# Altium schematic sheet controller.schdoc: RaToPUS DC/DC: Controller
size A4; Author: Lalit Patnaik; Organization: BE-CO-HT, CERN; Address1: Esplanade des Particules 1; Address2: 1217 Meyrin, Switzerland; Revision: 0.3; SheetNumber: 3; SheetTotal: 3
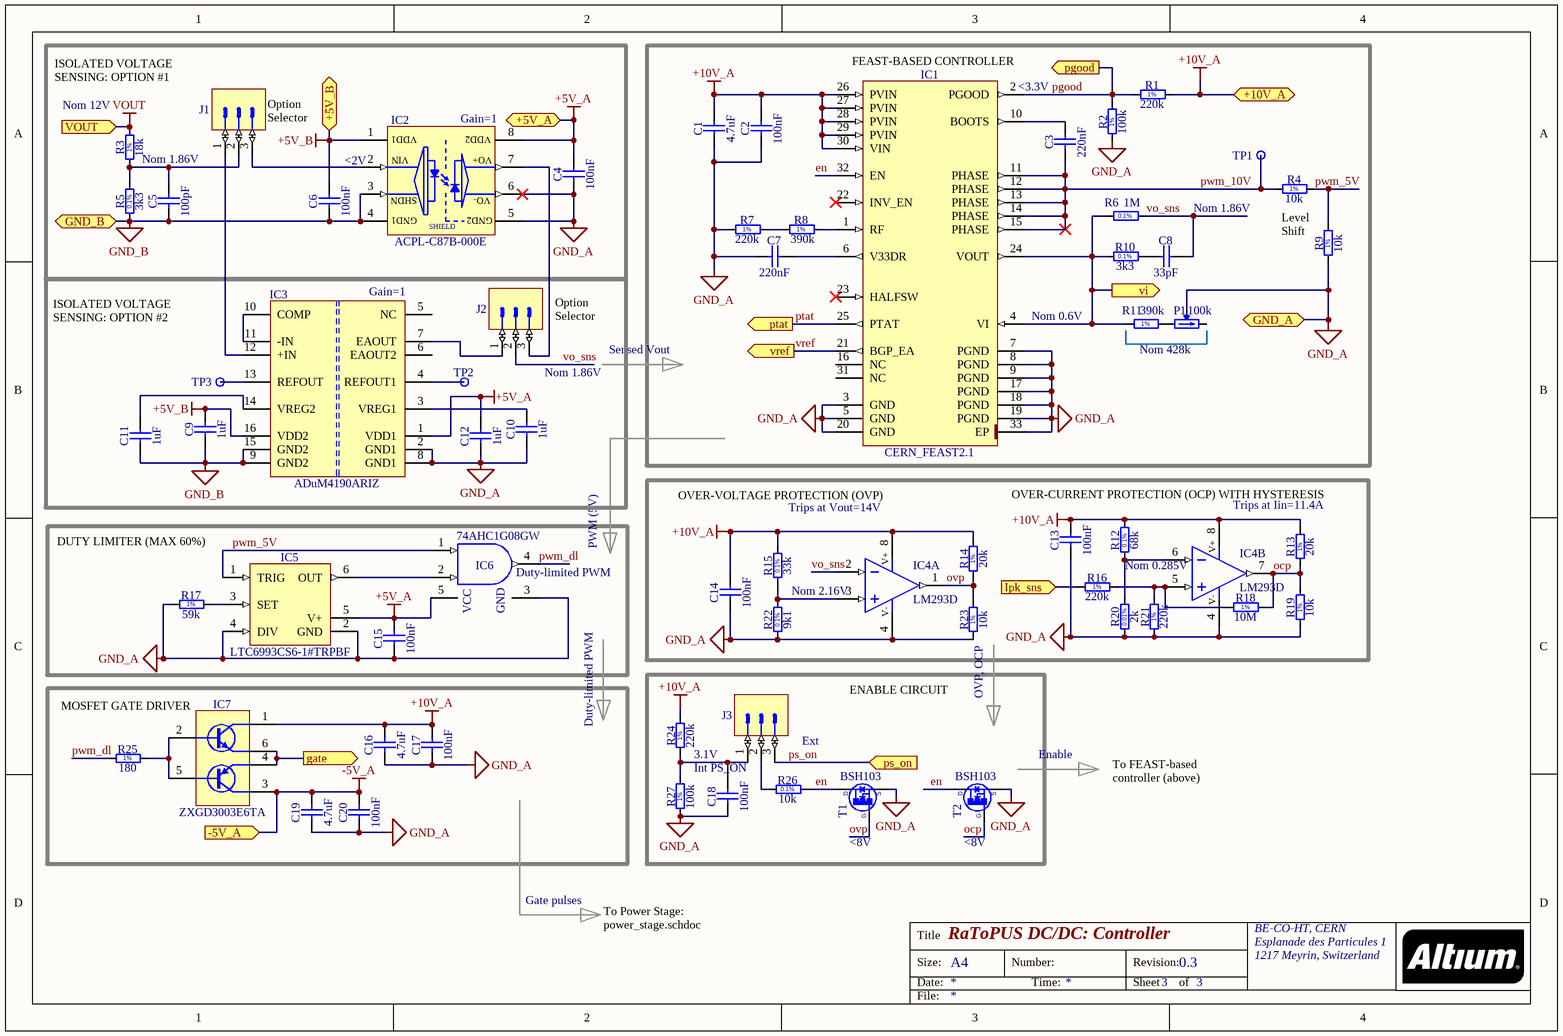
[diagram p0: controller.schdoc]

## Parts
C1  4.7uF  [CAPC2012X135N]
C2  100nF  [CAPC2012X135N]
C3  220nF  [CAPC2012X135N]
C4  100nF  [CAPC2012X135N]
C5  100pF  [CAPC2012X88N]
C6  100nF  [CAPC2012X135N]
C7  220nF  [CAPC2012X135N]
C8  33pF  [CAPC2012X88N]
C9  1uF  [CAPC3216X140N]
C10  1uF  [CAPC3216X140N]
C11  1uF  [CAPC3216X140N]
C12  1uF  [CAPC3216X140N]
C13  100nF  [CAPC2012X135N]
C14  100nF  [CAPC2012X135N]
C15  100nF  [CAPC2012X135N]
C16  4.7uF  [CAPC2012X135N]
C17  100nF  [CAPC2012X135N]
C18  100nF  [CAPC2012X135N]
C19  4.7uF  [CAPC2012X135N]
C20  100nF  [CAPC2012X135N]
IC1  CERN_FEAST2.1  [CERN_FEAST2.1]
IC2  ACPL-C87B-000E  [AVAGO_ACPL-C87B]
IC3  ADuM4190ARIZ  [SOIC127P1031X264-16N]
IC4  LM293D  [SOIC127P600X175-8N]  (parts A,B of 2)
IC5  LTC6993CS6-1#TRPBF  [SOT95P280X100-6N]
IC6  74AHC1G08GW  [SOT65P212X110-5N]
IC7  ZXGD3003E6TA  [SOT95P285X140-6N]
J1  Header 3  [JST_B3B-XH-A(LF)(SN)]  (value not drawn)
J2  Header 3  [JST_B3B-XH-A(LF)(SN)]  (value not drawn)
J3  Header 3  [JST_B3B-XH-A(LF)(SN)]  (value not drawn)
P1  100k  [TRIM_VISHAY_TSM4YL]
R1  220k  [RESC2012X60N]
R2  100k  [RESC2012X60N]
R3  18k  [RESC2012X60N]
R4  10k  [RESC2012X60N]
R5  3k3  [RESC2012X60N]
R6  1M  [RESC2012X60N]
R7  220k  [RESC2012X60N]
R8  390k  [RESC2012X60N]
R9  10k  [RESC2012X60N]
R10  3k3  [RESC2012X60N]
R11  390k  [RESC2012X60N]
R12  68k  [RESC2012X60N]
R13  20k  [RESC2012X60N]
R14  20k  [RESC2012X60N]
R15  33k  [RESC2012X60N]
R16  220k  [RESC2012X60N]
R17  59k  [RESC2012X60N]
R18  10M  [RESC2012X60N]
R19  10k  [RESC2012X60N]
R20  2k  [RESC2013X64N]
R21  220k  [RESC2012X60N]
R22  9k1  [RESC2012X60N]
R23  10k  [RESC2012X60N]
R24  220k  [RESC2012X60N]
R25  180  [RESC2012X60N]
R26  10k  [RESC2012X60N]
R27  100k  [RESC2012X60N]
T1  BSH103  [SOT95P230X110-3N]
T2  BSH103  [SOT95P230X110-3N]
TP1  Test Point  [VERO_20-2136]  (value not drawn)
TP2  Test Point  [VERO_20-2136]  (value not drawn)
TP3  Test Point  [VERO_20-2136]  (value not drawn)

## Blocks framed on the sheet
Duty-limited PWM: C16 C17 C19 C20 IC7 R25

## Ports
+5V_A, +5V_B, +10V_A, -5V_A (in), gate (out), GND_A, GND_B, Ipk_sns (in), pgood (out), ps_on (in), ptat (out), vi (out), VOUT (in), vref (out)

## Nets
+5V_A: C4.2 C12.2 C15.2 IC2.8(VDD2) IC3.1(VDD1) IC5.5(V+) IC6.5(VCC) ; port +5V_A
+5V_B: C6.2 C9.2 IC2.1(VDD1) IC3.16(VDD2) ; port +5V_B
+10V_A: C1.2 C2.2 C13.2 C14.2 C16.2 C17.2 IC1.26(PVIN) IC1.27(PVIN) IC1.28(PVIN) IC1.29(PVIN) IC1.30(VIN) IC4.8(V+) IC7.1(VCC) R1.2 R12.2 R13.2 R14.2 R15.2 R24.2 ; port +10V_A
-5V_A: C19.2 C20.2 IC7.3(VEE) ; port -5V_A
GND_A: C1.1 C2.1 C4.1 C7.1 C10.1 C12.1 C13.1 C14.1 C15.1 C16.1 C17.1 C18.1 C19.1 C20.1 IC1.3(GND) IC1.5(GND) IC1.7(PGND) IC1.8(PGND) IC1.9(PGND) IC1.17(PGND) IC1.18(PGND) IC1.19(PGND) IC1.20(GND) IC1.33(EP) IC2.5(GND2) IC2.6(VOUT-) IC3.2(GND1) IC3.8(GND1) IC4.4(V-) IC5.2(GND) IC5.4(DIV) IC6.3(GND) P1.2(W) R2.1 R7.1 R9.1 R17.1 R19.1 R20.1 R21.1 R22.1 R23.1 R27.1 T1.2(S) T2.2(S) ; port GND_A
GND_B: C5.1 C6.1 C9.1 C11.1 IC2.3(SHDN) IC2.4(GND1) IC3.9(GND2) IC3.15(GND2) R5.1 ; port GND_B
VOUT: R3.2 ; port VOUT
en: IC1.32(EN) R26.2 T1.3(D) T2.3(D)
gate: IC7.4(SINK) IC7.6(S) ; port gate
Ipk_sns: R16.1 ; port Ipk_sns
ocp: IC4.7(OUT) R13.1 R18.2 R19.2 T2.1(G)
ovp: IC4.1(OUT) R14.1 R23.2 T1.1(G)
pgood: IC1.2(PGOOD) R1.1 R2.2 ; port pgood
ps_on: J3.3 ; port ps_on
ptat: IC1.25(PTAT) ; port ptat
pwm_5V: IC5.1(TRIG) IC6.1(B) R4.2 R9.2
pwm_10V: C3.1 IC1.11(PHASE) IC1.12(PHASE) IC1.13(PHASE) IC1.14(PHASE) IC1.15(PHASE) R4.1 TP1.1
pwm_dl: IC6.4(Y) R25.1
vi: IC1.4(VI) IC1.24(VOUT) R6.1 R10.1 R11.1 ; port vi
vo_sns: C8.2 IC4.2(IN-) J2.2 R6.2
vref: IC1.21(BGP_EA) ; port vref
NetC3_2: C3.2 IC1.10(BOOTS)
NetC5_2: C5.2 J1.2 R3.1 R5.2
NetC7_2: C7.2 IC1.6(V33DR)
NetC8_1: C8.1 R10.2
NetC10_2: C10.2 IC3.3(VREG1)
NetC11_2: C11.2 IC3.14(VREG2)
NetC18_2: C18.2 J3.1 R24.1 R27.2
NetIC1_1: IC1.1(RF) R8.2
NetIC2_2: IC2.2(VIN) J1.3
NetIC2_7: IC2.7(VOUT+) J2.3
NetIC3_4: IC3.4(REFOUT1) TP2.1
NetIC3_7: IC3.7(EAOUT) J2.1
NetIC3_10: IC3.10(COMP) IC3.11(-IN)
NetIC3_12: IC3.12(+IN) J1.1
NetIC3_13: IC3.13(REFOUT) TP3.1
NetIC4_3: IC4.3(IN+) R15.1 R22.2
NetIC4_5: IC4.5(IN+) R16.2 R18.1 R21.2
NetIC4_6: IC4.6(IN-) R12.1 R20.2
NetIC5_3: IC5.3(SET) R17.2
NetIC5_6: IC5.6(OUT) IC6.2(A)
NetIC7_2: IC7.2(IN1) IC7.5(IN2) R25.2
NetJ3_2: J3.2 R26.1
NetP1_1: P1.1(CCW) R11.2
NetR7_2: R7.2 R8.1

Not connected (* = marked no-connect by the designer): IC1 16(NC) 22(INV_EN)* 23(HALFSW)* 31(NC); IC3 5(NC) 6(EAOUT2); P1 3(CW)

## Notes on the sheet
- ISOLATED VOLTAGE SENSING: OPTION #1
- (near R3) Nom 12V
- (near IC1) FEAST-BASED CONTROLLER
- (near IC1) <3.3V
- (near R3) Nom 1.86V
- (near J1) Option Selector
- <2V
- (near IC2) Gain=1
- Nom 1.86V
- Level Shift
- (near IC3) Gain=1
- ISOLATED VOLTAGE SENSING: OPTION #2
- (near J2) Option Selector
- Sensed Vout
- Nom 0.6V
- Nom 428k
- OVER-VOLTAGE PROTECTION (OVP)
- Trips at Vout=14V
- OVER-CURRENT PROTECTION (OCP) WITH HYSTERESIS
- Trips at Iin=11.4A
- DUTY LIMITER (MAX 60%)
- (near IC6) Duty-limited PWM
- PWM (5V)
- Nom 0.285V
- (near IC6) VCC
- (near IC6) GND
- Nom 2.16V
- (near IC7) MOSFET GATE DRIVER
- ENABLE CIRCUIT
- (near R23) OVP, OCP
- (near R24) 3.1V
- Int PS_ON
- Ext
- Enable
- To FEAST-based controller (above)
- (near T1) <8V
- (near T2) <8V
- Gate pulses
- To Power Stage:
  power_stage.schdoc
- Title
- Size:
- Date:
- A4
- Number:
- Time:
- Revision:
- Sheet
- of
- File:
- (in symbol ACPL-C87B-000E) VO+; VO-; SHIELD
- (in symbol R0805_1M_0.1%_0.1W_25PPM) 0.1%
- (in symbol R0805_2K_0.01%_0.2W_0.2PPM_VISHAY_VSMP) 0.01%
- (in symbol R0805_3K3_0.1%_0.125W_25PPM) 0.1%
- (in symbol R0805_9K1_0.1%_0.1W_10PPM) 0.1%
- (in symbol R0805_10K_0.1%_0.1W_10PPM) 0.1%
- (in symbol R0805_10K_1%_0.125W_100PPM) 1%
- (in symbol R0805_10M_1%_0.125W_100PPM) 1%
- (in symbol R0805_18K_1%_0.125W_100PPM) 1%
- (in symbol R0805_20K_1%_0.125W_100PPM) 1%
- (in symbol R0805_33K_0.1%_0.125W_25PPM) 0.1%
- (in symbol R0805_59K_1%_0.125W_100PPM) 1%
- (in symbol R0805_68K_0.1%_0.125W_25PPM) 0.1%
- (in symbol R0805_100K_1%_0.125W_100PPM) 1%
- (in symbol R0805_180R_1%_0.125W_100PPM) 1%
- (in symbol R0805_220K_1%_0.125W_100PPM) 1%
- (in symbol R0805_390K_1%_0.125W_100PPM) 1%

## Library data of the parts
C1 C16 C19 = CC0805_4.7UF_16V_10%_X7R: Non-polarised capacitor; Part Description: SMD Multilayer Chip Ceramic Capacitor; Manufacturer: GENERIC; Manufacturer1 Part Number: EMK212B7475KG-T; Voltage: 16V; TC: X7R; Tolerance: ±10%; Part Number: CC0805_4.7UF_16V_10%_X7R; Component Kind: Standard; Component Type: Standard; Pin Count: 2; Value: 4.7uF; Status: Preferred; Manufacturer Part Number: CC0805_4.7UF_16V_10%_X7R; Case: 0805; Mounted: Yes; Socket: No; SMD: Yes; Sense: No; Manufacturer1 Example: TAIYO YUDEN; Manufacturer1 ComponentHeight: 1.35mm; HelpURL: \\cern.ch\dfs\Applications\Altium\Datasheets\CC0805_X7R_TAIYO-YUDEN_HIGH-VALUE.pdf; Author: CERN DEM JLC; CreateDate: 16/09/2014; LatestRevisionDate: 16/09/2014
C2 C4 C6 C13-C15 C17 C18 C20 = CC0805_100NF_50V_10%_X7R: Non-polarised capacitor; Part Description: SMD Multilayer Chip Ceramic Capacitor; Manufacturer: GENERIC; Manufacturer1 Part Number: C2012X7R1H104K085AA; Voltage: 50V; TC: X7R; Tolerance: ±10%; Part Number: CC0805_100NF_50V_10%_X7R; Component Kind: Standard; Component Type: Standard; Pin Count: 2; Value: 100nF; Status: Preferred; Manufacturer Part Number: CC0805_100NF_50V_10%_X7R; Case: 0805; Mounted: Yes; Socket: No; SMD: Yes; Sense: No; Manufacturer1 Example: TDK; Manufacturer1 ComponentHeight: 1mm; HelpURL: \\cern.ch\dfs\Applications\Altium\Datasheets\CC0805_X7R_TDK_C.pdf; Author: CERN DEM JLC; CreateDate: 03/12/2007; LatestRevisionDate: 22/04/2015
C3 C7 = CC0805_220NF_50V_10%_X7R: Non-polarised capacitor; Part Description: SMD Multilayer Chip Ceramic Capacitor; Manufacturer: GENERIC; Manufacturer1 Part Number: GRM21BR71H224KA01L; Voltage: 50V; TC: X7R; Tolerance: ±10%; Part Number: CC0805_220NF_50V_10%_X7R; Component Kind: Standard; Component Type: Standard; Pin Count: 2; Value: 220nF; Status: Preferred; Manufacturer Part Number: CC0805_220NF_50V_10%_X7R; Case: 0805; Mounted: Yes; Socket: No; SMD: Yes; Sense: No; Manufacturer1 Example: MURATA; Manufacturer1 ComponentHeight: 1.35mm; HelpURL: \\cern.ch\dfs\Applications\Altium\Datasheets\CC0805_X7R_MURATA.pdf; Author: CERN DEM JLC; CreateDate: 03/12/2007; LatestRevisionDate: 03/12/2007
C5 = CC0805_100PF_50V_5%_C0G_KEMET_C0805C101J5GACAUTO: Non-polarised capacitor; Part Description: SMD Multilayer Chip Ceramic Capacitor (Automotive Grade); Manufacturer: KEMET; Voltage: 50V; TC: C0G/NP0; Tolerance: ±5%; Part Number: CC0805_100PF_50V_5%_C0G_KEMET_C0805C101J5GACAUTO; Component Kind: Standard; Component Type: Standard; Pin Count: 2; Value: 100pF; Status: Not Recommended; Manufacturer Part Number: C0805C101J5GACAUTO; Case: 0805; Mounted: Yes; Socket: No; SMD: Yes; Sense: No; ComponentHeight: 0.88mm; HelpURL: \\cern.ch\dfs\Applications\Altium\Datasheets\CC0805_KEMET_C0805C101J5GACAUTO.pdf; Author: CERN DEM BC; CreateDate: 26/02/2016; LatestRevisionDate: 26/02/2016
C8 = CC0805_33PF_50V_5%_C0G_KEMET_C0805C330J5GACAUTO: Non-polarised capacitor; Part Description: SMD Multilayer Chip Ceramic Capacitor (Automotive Grade); Manufacturer: KEMET; Voltage: 50V; TC: CG0/NP0; Tolerance: ±5%; Part Number: CC0805_33PF_50V_5%_C0G_KEMET_C0805C330J5GACAUTO; Component Kind: Standard; Component Type: Standard; Pin Count: 2; Value: 33pF; Status: Not Recommended; Manufacturer Part Number: C0805C330J5GACAUTO; Case: 0805; Mounted: Yes; Socket: No; SMD: Yes; Sense: No; ComponentHeight: 0.88mm; HelpURL: \\cern.ch\dfs\Applications\Altium\Datasheets\CC0805_KEMET_C0805C330J5GACAUTO.pdf; Author: CERN DEM BC; CreateDate: 29/02/2016; LatestRevisionDate: 29/02/2016
C9-C12 = CC1206_1UF_50V_10%_X7R: Non-polarised capacitor; Part Description: SMD Multilayer Chip Ceramic Capacitor; Manufacturer: GENERIC; Manufacturer1 Part Number: C1206F105K5RACTU; Voltage: 50V; TC: X7R; Tolerance: ±10%; Part Number: CC1206_1UF_50V_10%_X7R; Component Kind: Standard; Component Type: Standard; Pin Count: 2; Value: 1uF; Status: Preferred; Manufacturer Part Number: CC1206_1UF_50V_10%_X7R; Case: 1206; Mounted: Yes; Socket: No; SMD: Yes; Sense: No; Manufacturer1 Example: KEMET; Manufacturer1 ComponentHeight: 1.8mm; HelpURL: \\cern.ch\dfs\Applications\Altium\Datasheets\CC1206_X7R_KEMET_OPENMODE.pdf; Author: CERN DEM JLC; CreateDate: 07/11/2012; LatestRevisionDate: 07/11/2012
IC1 = CERN_FEAST2.1: Radiation tolerant 10W Synchronous Step-Down Buck DC/DC converter; Manufacturer: CERN; PressFit: No; Bonding: No; Part Number: CERN_FEAST2.1; Component Kind: Standard; Component Type: Standard; Device: CERN_FEAST2.1; PackageDescription: QFN, 0.50mm Pitch, Square; 8 Pin X 8 Pin, 5mm X 5mm X 0.9mm H Body (w/Thermal Tab 3.6 X 3.6mm); Part Description: Radiation Tolerant 10W Synchronous Step-Down Buck DC/DC converter; Manufacturer Part Number: FEAST2.1; Pin Count: 33; Case: QFN32; Mounted: Yes; Socket: No; SMD: Yes; Sense: No; ComponentHeight: 0.9mm; HelpURL: \\cern.ch\dfs\Applications\Altium\Datasheets\CERN_FEAST2.1.pdf; Author: CERN DEM JLC; CreateDate: 25/09/2018; LatestRevisionDate: 25/09/2018
IC2 = ACPL-C87B-000E: Precision Optically Isolated Voltage Sensor; Part Description: Precision Optically Isolated Voltage Sensor (±0.5% Gain Tolerance); Manufacturer: AVAGO TECHNOLOGIES; PressFit: No; Bonding: No; Part Number: ACPL-C87B-000E; Component Kind: Standard; Component Type: Standard; Device: ACPL-C87B-000E; PackageDescription: 8-Leads Stretched Surface Mount SO Package, Body 6.807x5.859mm, Pitch 1.27mm; Manufacturer Part Number: ACPL-C87B-000E; Pin Count: 8; Case: SOIC8; Mounted: Yes; Socket: No; SMD: Yes; Sense: No; ComponentHeight: 3.6mm; HelpURL: \\cern.ch\dfs\Applications\Altium\Datasheets\ACPL-C87B-000E.pdf; Author: CERN DEM JLC; CreateDate: 13/08/2013; LatestRevisionDate: 13/08/2013
IC3 = ADuM4190ARIZ: High Stability Isolated Error Amplifier; Part Description: 200kHz High Stability Isolated Error Amplifier; Manufacturer: ANALOG DEVICES; PressFit: No; Bonding: No; Part Number: ADuM4190ARIZ; Component Kind: Standard; Component Type: Standard; Device: ADuM4190ARIZ; PackageDescription: SOIC, 1.27mm Pitch;16 Pin, 7.49mm W X 10.21mm L X 2.64mm H body, IPC Medium Density; Manufacturer Part Number: ADuM4190ARIZ; Pin Count: 16; Case: SOIC16; Mounted: Yes; Socket: No; SMD: Yes; Sense: No; ComponentHeight: 2.64mm; Author: CERN DEM JLC; HelpURL: \\cern.ch\dfs\Applications\Altium\Datasheets\ADuM4190ARIZ.pdf; CreateDate: 21/08/2014; LatestRevisionDate: 21/08/2014
IC4 = LM293D: Dual Operational Amplifier; Part Description: Dual Differential Comparator; Manufacturer: TEXAS INSTRUMENTS; PressFit: No; Bonding: No; Part Number: LM293D; Component Kind: Standard; Component Type: Standard; Device: LM293D; PackageDescription: SOIC 8, Pitch 1.27mm, Body 4x5mm, IPC Medium Density; Manufacturer Part Number: LM293D; Pin Count: 8; Case: SOIC8; Mounted: Yes; Socket: No; SMD: Yes; Sense: No; ComponentHeight: 1.75mm; Author: CERN DEM JMW; HelpURL: \\cern.ch\dfs\Applications\Altium\Datasheets\LM293D.pdf; CreateDate: 30/08/2016; LatestRevisionDate: 30/08/2016
IC5 = LTC6993CS6-1#TRPBF: TimerBlox: Monostable Pulse Generator (One Shot); Manufacturer: LINEAR TECHNOLOGY; PressFit: No; Bonding: No; Part Number: LTC6993CS6-1#TRPBF; Component Kind: Standard; Component Type: Standard; Device: LTC6993CS6-1#TRPBF; PackageDescription: SOT23, 0.95mm pitch; 6 pin, 1.625mm W X 2.90mm L X 1.00mm H body, IPC Medium Density; Part Description: TimerBlox: Monostable Pulse Generator (One Shot); Manufacturer Part Number: LTC6993CS6-1#TRPBF; Pin Count: 6; Case: SOT23-6; Mounted: Yes; Socket: No; SMD: Yes; Sense: No; ComponentHeight: 1mm; Author: CERN DEM JLC; HelpURL: \\cern.ch\dfs\Applications\Altium\Datasheets\LTC6993CS6-1#TRPBF.pdf; CreateDate: 05/03/2019; LatestRevisionDate: 05/03/2019
IC6 = 74AHC1G08GW: Single 2-Input AND Gate; Manufacturer: NXP SEMICONDUCTORS; PressFit: No; Bonding: No; Part Number: 74AHC1G08GW; Component Kind: Standard; Component Type: Standard; Device: 74AHC1G08GW; PackageDescription: SOT353, SOT, 0.65mm Pitch, 5 pin, 1.25mm W X 2.05mm L X 1.10mm H, IPC Medium Density; Part Description: Single 2-Input AND Gate; Manufacturer Part Number: 74AHC1G08GW; Pin Count: 5; Case: SOT353; Mounted: Yes; Socket: No; SMD: Yes; Sense: No; ComponentHeight: 1.1mm; Author: CERN DEM JLC; HelpURL: \\cern.ch\dfs\Applications\Altium\Datasheets\74AHC1G08GW.pdf; CreateDate: 31/08/2010; LatestRevisionDate: 31/08/2010
IC7 = ZXGD3003E6TA: 40V 5A Gate Driver; Manufacturer: DIODES INCORPORATED; PressFit: No; Bonding: No; Part Number: ZXGD3003E6TA; Component Kind: Standard; Component Type: Standard; Device: ZXGD3003E6TA; PackageDescription: SOT23, 0.95mm Pitch; 6 Pin, 1.60mm W X 3.00mm L X 1.40mm H Body, IPC Medium Density; Part Description: 40V 5A Gate Driver; Manufacturer Part Number: ZXGD3003E6TA; Pin Count: 6; Case: SOT23-6; Mounted: Yes; Socket: No; SMD: Yes; Sense: No; ComponentHeight: 1.4mm; HelpURL: \\cern.ch\dfs\Applications\Altium\Datasheets\ZXGD3003E6TA.pdf; Author: CERN DEM JLC; CreateDate: 05/03/2019; LatestRevisionDate: 05/03/2019
J1-J3 = JST_B3B-XH-A(LF)(SN): Connector 3 Male; Part Description: 3 Contacts, 2.5mm Pitch, Top Entry Type Shrouded Header; Manufacturer: JST (JAPAN SOLDERLESS TERMINALS); PressFit: No; Part Number: JST_B3B-XH-A(LF)(SN); Component Kind: Standard; Component Type: Standard; Pin Count: 3; Family: Header 3; Mounted: Yes; Socket: No; SMD: No; Sense: No; Status: None; Manufacturer Part Number: B3B-XH-A(LF)(SN); ComponentHeight: 7mm; HelpURL: \\cern.ch\dfs\Applications\Altium\Datasheets\JST_B3B-XH-A(LF)(SN).pdf; Author: CERN DEM JLC; CreateDate: 14/08/2014; LatestRevisionDate: 14/08/2014
P1 = TRIM_11T_100K_VISHAY_TSM4YL104KR05: Trimming Potentiometer; Part Description: 11 Turns SMD Trimming Potentiometer (Top Adjust); Manufacturer: VISHAY SFERNICE; Power: 0.25W; TC: ±100ppm/°C; Tolerance: ±10%; PressFit: No; Part Number: TRIM_11T_100K_VISHAY_TSM4YL104KR05; Component Kind: Standard; Component Type: Standard; Pin Count: 3; Value: 100k; Manufacturer Part Number: TSM4YL104KR05; Case: TSM4YL; Mounted: Yes; Socket: No; SMD: Yes; Sense: No; ComponentHeight: 5.3mm; HelpURL: \\cern.ch\dfs\Applications\Altium\Datasheets\TRIM_VISHAY_TSM4YL.pdf; Author: CERN DEM JLC; CreateDate: 11/04/2013; LatestRevisionDate: 11/04/2013
R1 R7 R16 R21 R24 = R0805_220K_1%_0.125W_100PPM: Resistor - 1%; Part Description: General Purpose Thick Film Chip Resistor; Manufacturer: GENERIC; Manufacturer1 Part Number: NRC10F2203TRF; Power: 0.125W; TC: ±100ppm/°C; PressFit: No; Part Number: R0805_220K_1%_0.125W_100PPM; Component Kind: Standard; Component Type: Standard; Pin Count: 2; Value: 220k; Status: Preferred; Tolerance: ±1%; Manufacturer Part Number: R0805_220K_1%_0.125W_100PPM; Case: 0805; Mounted: Yes; Sense: No; Socket: No; SMD: Yes; Manufacturer1 Example: NIC COMPONENT; Manufacturer1 ComponentHeight: 0.6mm; HelpURL: \\cern.ch\dfs\Applications\Altium\Datasheets\R0805_NIC_NRC.pdf; Author: CERN DEM JLC; CreateDate: 03/12/2007; LatestRevisionDate: 13/03/2008
R2 R27 = R0805_100K_1%_0.125W_100PPM: Resistor - 1%; Part Description: General Purpose Thick Film Chip Resistor; Manufacturer: GENERIC; Manufacturer1 Part Number: NRC10F1003TRF; Power: 0.125W; TC: ±100ppm/°C; PressFit: No; Part Number: R0805_100K_1%_0.125W_100PPM; Component Kind: Standard; Component Type: Standard; Pin Count: 2; Value: 100k; Status: Preferred; Tolerance: ±1%; Manufacturer Part Number: R0805_100K_1%_0.125W_100PPM; Case: 0805; Mounted: Yes; Sense: No; Socket: No; SMD: Yes; Manufacturer1 Example: NIC COMPONENT; Manufacturer1 ComponentHeight: 0.6mm; HelpURL: \\cern.ch\dfs\Applications\Altium\Datasheets\R0805_NIC_NRC.pdf; Author: CERN DEM JLC; CreateDate: 03/12/2007; LatestRevisionDate: 13/03/2008
R3 = R0805_18K_1%_0.125W_100PPM: Resistor - 1%; Part Description: General Purpose Thick Film Chip Resistor; Manufacturer: GENERIC; Manufacturer1 Part Number: NRC10F1802TRF; Power: 0.125W; TC: ±100ppm/°C; PressFit: No; Part Number: R0805_18K_1%_0.125W_100PPM; Component Kind: Standard; Component Type: Standard; Pin Count: 2; Value: 18k; Status: Preferred; Tolerance: ±1%; Manufacturer Part Number: R0805_18K_1%_0.125W_100PPM; Case: 0805; Mounted: Yes; Sense: No; Socket: No; SMD: Yes; Manufacturer1 Example: NIC COMPONENT; Manufacturer1 ComponentHeight: 0.6mm; HelpURL: \\cern.ch\dfs\Applications\Altium\Datasheets\R0805_NIC_NRC.pdf; Author: CERN DEM JLC; CreateDate: 03/12/2007; LatestRevisionDate: 13/03/2008
R4 R9 R19 R23 = R0805_10K_1%_0.125W_100PPM: Resistor - 1%; Part Description: General Purpose Thick Film Chip Resistor; Manufacturer: GENERIC; Manufacturer1 Part Number: NRC10F1002TRF; Power: 0.125W; TC: ±100ppm/°C; PressFit: No; Part Number: R0805_10K_1%_0.125W_100PPM; Component Kind: Standard; Component Type: Standard; Pin Count: 2; Value: 10k; Status: Preferred; Tolerance: ±1%; Manufacturer Part Number: R0805_10K_1%_0.125W_100PPM; Case: 0805; Mounted: Yes; Sense: No; Socket: No; SMD: Yes; Manufacturer1 Example: NIC COMPONENT; Manufacturer1 ComponentHeight: 0.6mm; HelpURL: \\cern.ch\dfs\Applications\Altium\Datasheets\R0805_NIC_NRC.pdf; Author: CERN DEM JLC; CreateDate: 03/12/2007; LatestRevisionDate: 13/03/2008
R5 R10 = R0805_3K3_0.1%_0.125W_25PPM: Resistor - 0.1%; Part Description: Thin Film Chip Resistor; Manufacturer: GENERIC; Manufacturer1 Part Number: ERA6AEB332V; Power: 0.125W; TC: ±25ppm; PressFit: No; Part Number: R0805_3K3_0.1%_0.125W_25PPM; Component Kind: Standard; Component Type: Standard; Pin Count: 2; Value: 3k3; Status: Not Recommended; Tolerance: ±0.1%; Manufacturer Part Number: R0805_3K3_0.1%_0.125W_25PPM; Case: 0805; Mounted: Yes; Sense: No; Socket: No; SMD: Yes; Manufacturer1 Example: PANASONIC; Manufacturer1 ComponentHeight: 0.6mm; HelpURL: \\cern.ch\dfs\Applications\Altium\Datasheets\R0805_PANASONIC_ERA.pdf; Author: CERN DEM JLC; CreateDate: 07/06/2018; LatestRevisionDate: 07/06/2018
R6 = R0805_1M_0.1%_0.1W_25PPM: Resistor - 0.1%; Part Description: Precision Surface Mount Resistor; Manufacturer: GENERIC; Manufacturer1 Part Number: PCF0805R-1M0BT1; Power: 0.1W; TC: ±25ppm/°C; PressFit: No; Part Number: R0805_1M_0.1%_0.1W_25PPM; Component Kind: Standard; Component Type: Standard; Pin Count: 2; Value: 1M; Status: Not Recommended; Tolerance: ±0.1%; Manufacturer Part Number: R0805_1M_0.1%_0.1W_25PPM; Case: 0805; Mounted: Yes; Sense: No; Socket: No; SMD: Yes; Manufacturer1 Example: TT ELECTRONICS; Manufacturer1 ComponentHeight: 0.65mm; HelpURL: \\cern.ch\dfs\Applications\Altium\Datasheets\R0805_TT ELECTRONICS_PCF.pdf; Author: CERN DEM JLC; CreateDate: 17/11/2008; LatestRevisionDate: 25/10/2018
R8 R11 = R0805_390K_1%_0.125W_100PPM: Resistor - 1%; Part Description: General Purpose Thick Film Chip Resistor; Manufacturer: GENERIC; Manufacturer1 Part Number: NRC10F3903TRF; Power: 0.125W; TC: ±100ppm/°C; PressFit: No; Part Number: R0805_390K_1%_0.125W_100PPM; Component Kind: Standard; Component Type: Standard; Pin Count: 2; Value: 390k; Status: Preferred; Tolerance: ±1%; Manufacturer Part Number: R0805_390K_1%_0.125W_100PPM; Case: 0805; Mounted: Yes; Sense: No; Socket: No; SMD: Yes; Manufacturer1 Example: NIC COMPONENT; Manufacturer1 ComponentHeight: 0.6mm; HelpURL: \\cern.ch\dfs\Applications\Altium\Datasheets\R0805_NIC_NRC.pdf; Author: CERN DEM JLC; CreateDate: 03/12/2007; LatestRevisionDate: 13/03/2008
R12 = R0805_68K_0.1%_0.125W_25PPM: Resistor - 0.1%; Part Description: Thin Film Chip Resistor; Manufacturer: GENERIC; Manufacturer1 Part Number: ERA6AEB683V; Power: 0.125W; TC: ±25ppm; PressFit: No; Part Number: R0805_68K_0.1%_0.125W_25PPM; Component Kind: Standard; Component Type: Standard; Pin Count: 2; Value: 68k; Status: Not Recommended; Tolerance: ±0.1%; Manufacturer Part Number: R0805_68K_0.1%_0.125W_25PPM; Case: 0805; Mounted: Yes; Sense: No; Socket: No; SMD: Yes; Manufacturer1 Example: PANASONIC; Manufacturer1 ComponentHeight: 0.6mm; HelpURL: \\cern.ch\dfs\Applications\Altium\Datasheets\R0805_PANASONIC_ERA.pdf; Author: CERN DEM JLC; CreateDate: 23/10/2013; LatestRevisionDate: 23/10/2013
R13 R14 = R0805_20K_1%_0.125W_100PPM: Resistor - 1%; Part Description: General Purpose Thick Film Chip Resistor; Manufacturer: GENERIC; Manufacturer1 Part Number: NRC10F2002TRF; Power: 0.125W; TC: ±100ppm/°C; PressFit: No; Part Number: R0805_20K_1%_0.125W_100PPM; Component Kind: Standard; Component Type: Standard; Pin Count: 2; Value: 20k; Status: Preferred; Tolerance: ±1%; Manufacturer Part Number: R0805_20K_1%_0.125W_100PPM; Case: 0805; Mounted: Yes; Sense: No; Socket: No; SMD: Yes; Manufacturer1 Example: NIC COMPONENT; Manufacturer1 ComponentHeight: 0.6mm; HelpURL: \\cern.ch\dfs\Applications\Altium\Datasheets\R0805_NIC_NRC.pdf; Author: CERN DEM JLC; CreateDate: 03/12/2007; LatestRevisionDate: 13/03/2008
R15 = R0805_33K_0.1%_0.125W_25PPM: Resistor - 0.1%; Part Description: Thin Film Chip Resistor; Manufacturer: GENERIC; Manufacturer1 Part Number: ERA6AEB333V; Power: 0.125W; TC: ±25ppm; PressFit: No; Part Number: R0805_33K_0.1%_0.125W_25PPM; Component Kind: Standard; Component Type: Standard; Pin Count: 2; Value: 33k; Status: Not Recommended; Tolerance: ±0.1%; Manufacturer Part Number: R0805_33K_0.1%_0.125W_25PPM; Case: 0805; Mounted: Yes; Sense: No; Socket: No; SMD: Yes; Manufacturer1 Example: PANASONIC; Manufacturer1 ComponentHeight: 0.6mm; HelpURL: \\cern.ch\dfs\Applications\Altium\Datasheets\R0805_PANASONIC_ERA.pdf; Author: CERN DEM JLC; CreateDate: 04/06/2015; LatestRevisionDate: 04/06/2015
R17 = R0805_59K_1%_0.125W_100PPM: Resistor - 1%; Part Description: Thick Film Chip Resistor; Manufacturer: VISHAY; Manufacturer1 Part Number: CRCW080559K0FKEA; Power: 0.125W; TC: ±100ppm/°C; PressFit: No; Part Number: R0805_59K_1%_0.125W_100PPM; Component Kind: Standard; Component Type: Standard; Pin Count: 2; Value: 59k; Status: None; Tolerance: ±1%; Manufacturer Part Number: R0805_59K_1%_0.125W_100PPM; Case: 0805; Mounted: Yes; Sense: No; Socket: No; SMD: Yes; Manufacturer1 Example: VISHAY; Manufacturer1 ComponentHeight: 0.6mm; HelpURL: \\cern.ch\dfs\Applications\Altium\Datasheets\R2512_VISHAY_CRCW0805.pdf; Author: CERN DEM JLC; CreateDate: 18/04/2013; LatestRevisionDate: 18/04/2013
R18 = R0805_10M_1%_0.125W_100PPM: Resistor - 1%; Part Description: General Purpose Thick Film Chip Resistor; Manufacturer: GENERIC; Manufacturer1 Part Number: NRC10F1005TRF; Power: 0.125W; TC: ±100ppm/°C; PressFit: No; Part Number: R0805_10M_1%_0.125W_100PPM; Component Kind: Standard; Component Type: Standard; Pin Count: 2; Value: 10M; Status: Preferred; Tolerance: ±1%; Manufacturer Part Number: R0805_10M_1%_0.125W_100PPM; Case: 0805; Mounted: Yes; Sense: No; Socket: No; SMD: Yes; Manufacturer1 Example: NIC COMPONENT; Manufacturer1 ComponentHeight: 0.6mm; HelpURL: \\cern.ch\dfs\Applications\Altium\Datasheets\R0805_NIC_NRC.pdf; Author: CERN DEM MR; CreateDate: 18/02/2016; LatestRevisionDate: 18/02/2016
R20 = R0805_2K_0.01%_0.2W_0.2PPM_VISHAY_VSMP: Resistor - 0.01%; Part Description: Ultra High Precision Foil Wraparound Surface Mount Chip Resistor; Manufacturer: VISHAY PRECISION; Manufacturer Part Number: Y16242K00000T9R; Power: 0.2W; TC: ±0.2ppm/°C; PressFit: No; Part Number: R0805_2K_0.01%_0.2W_0.2PPM_VISHAY_VSMP; Component Kind: Standard; Component Type: Standard; Pin Count: 2; Value: 2k; Status: None; Tolerance: ±0.01%; Case: 0805; Mounted: Yes; Sense: No; Socket: No; SMD: Yes; Manufacturer1 ComponentHeight: 0.64mm; HelpURL: \\cern.ch\dfs\Applications\Altium\Datasheets\R0805_VISHAY_VSMP.pdf; Author: CERN DEM JLC; CreateDate: 22/09/2011; LatestRevisionDate: 22/09/2011
R22 = R0805_9K1_0.1%_0.1W_10PPM: Resistor - 0.1%; Part Description: Thin Film Chip Resistor; Manufacturer: GENERIC; Manufacturer1 Part Number: RN73C2A9K1BTG; Power: 0.1W; TC: ±10ppm; PressFit: No; Part Number: R0805_9K1_0.1%_0.1W_10PPM; Component Kind: Standard; Component Type: Standard; Pin Count: 2; Value: 9k1; Status: Not Recommended; Tolerance: ±0.1%; Manufacturer Part Number: R0805_9K1_0.1%_0.1W_10PPM; Case: 0805; Mounted: Yes; Sense: No; Socket: No; SMD: Yes; Manufacturer1 Example: TYCO HOLSWORTHY; Manufacturer1 ComponentHeight: 0.6mm; HelpURL: \\cern.ch\dfs\Applications\Altium\Datasheets\R0805_Tyco_RN73.pdf; Author: CERN DEM JLC; CreateDate: 25/03/2014; LatestRevisionDate: 25/03/2014
R25 = R0805_180R_1%_0.125W_100PPM: Resistor - 1%; Part Description: General Purpose Thick Film Chip Resistor; Manufacturer: GENERIC; Manufacturer1 Part Number: NRC10F1800TRF; Power: 0.125W; TC: ±100ppm/°C; PressFit: No; Part Number: R0805_180R_1%_0.125W_100PPM; Component Kind: Standard; Component Type: Standard; Pin Count: 2; Value: 180; Status: Preferred; Tolerance: ±1%; Manufacturer Part Number: R0805_180R_1%_0.125W_100PPM; Case: 0805; Mounted: Yes; Sense: No; Socket: No; SMD: Yes; Manufacturer1 Example: NIC COMPONENT; Manufacturer1 ComponentHeight: 0.6mm; HelpURL: \\cern.ch\dfs\Applications\Altium\Datasheets\R0805_NIC_NRC.pdf; Author: CERN DEM JLC; CreateDate: 03/12/2007; LatestRevisionDate: 13/03/2008
R26 = R0805_10K_0.1%_0.1W_10PPM: Resistor - 0.1%; Part Description: Thin Film Chip Resistor; Manufacturer: GENERIC; Manufacturer1 Part Number: RN73C2A10KBTG; Power: 0.1W; TC: ±10ppm; PressFit: No; Part Number: R0805_10K_0.1%_0.1W_10PPM; Component Kind: Standard; Component Type: Standard; Pin Count: 2; Value: 10k; Status: Not Recommended; Tolerance: ±0.1%; Manufacturer Part Number: R0805_10K_0.1%_0.1W_10PPM; Case: 0805; Mounted: Yes; Sense: No; Socket: No; SMD: Yes; Manufacturer1 Example: TYCO HOLSWORTHY; Manufacturer1 ComponentHeight: 0.6mm; HelpURL: \\cern.ch\dfs\Applications\Altium\Datasheets\R0805_Tyco_RN73.pdf; Author: CERN DEM JLC; CreateDate: 03/12/2007; LatestRevisionDate: 13/03/2008
T1 T2 = BSH103: N-CHANNEL MOSFET WITH DIODE; Part Description: 30V 850mA N-Channel Enhancement Mode Field-Effect Transistor; Manufacturer: NEXPERIA; PressFit: No; Bonding: No; Part Number: BSH103; Component Kind: Standard; Component Type: Standard; Device: BSH103; PackageDescription: SOT23, 3 pin, Pitch 0.95mm - 1.3mm W X 2.9mm L X 1.1mm H, IPC Medium Density; Manufacturer Part Number: BSH103; Pin Count: 3; Case: SOT23-3; Mounted: Yes; Socket: No; SMD: Yes; Sense: No; ComponentHeight: 1.1mm; HelpURL: \\cern.ch\dfs\Applications\Altium\Datasheets\BSH103.pdf; Author: CERN DEM JLC; CreateDate: 16/03/2010; LatestRevisionDate: 20/06/2017
TP1-TP3 = VERO_20-2136: Part Description: Black Bead PCB Terminal Test Pin for 1.6mm PCB Thickness (1.32mm Hole); Manufacturer: VERO TECHNOLOGIES; PressFit: No; Part Number: VERO_20-2136; Component Kind: Standard; Component Type: Standard; Pin Count: 1; Family: Test Point; Mounted: Yes; Socket: No; SMD: No; Sense: No; Status: None; Manufacturer Part Number: 20-2136; ComponentHeight: 5.3mm; HelpURL: \\cern.ch\dfs\Applications\Altium\Datasheets\VERO_20-2136.pdf; Author: CERN DEM JLC; CreateDate: 21/07/2008; LatestRevisionDate: 15/07/2013